# EAGLE design TowerLight (EAGLE 6.6.0)
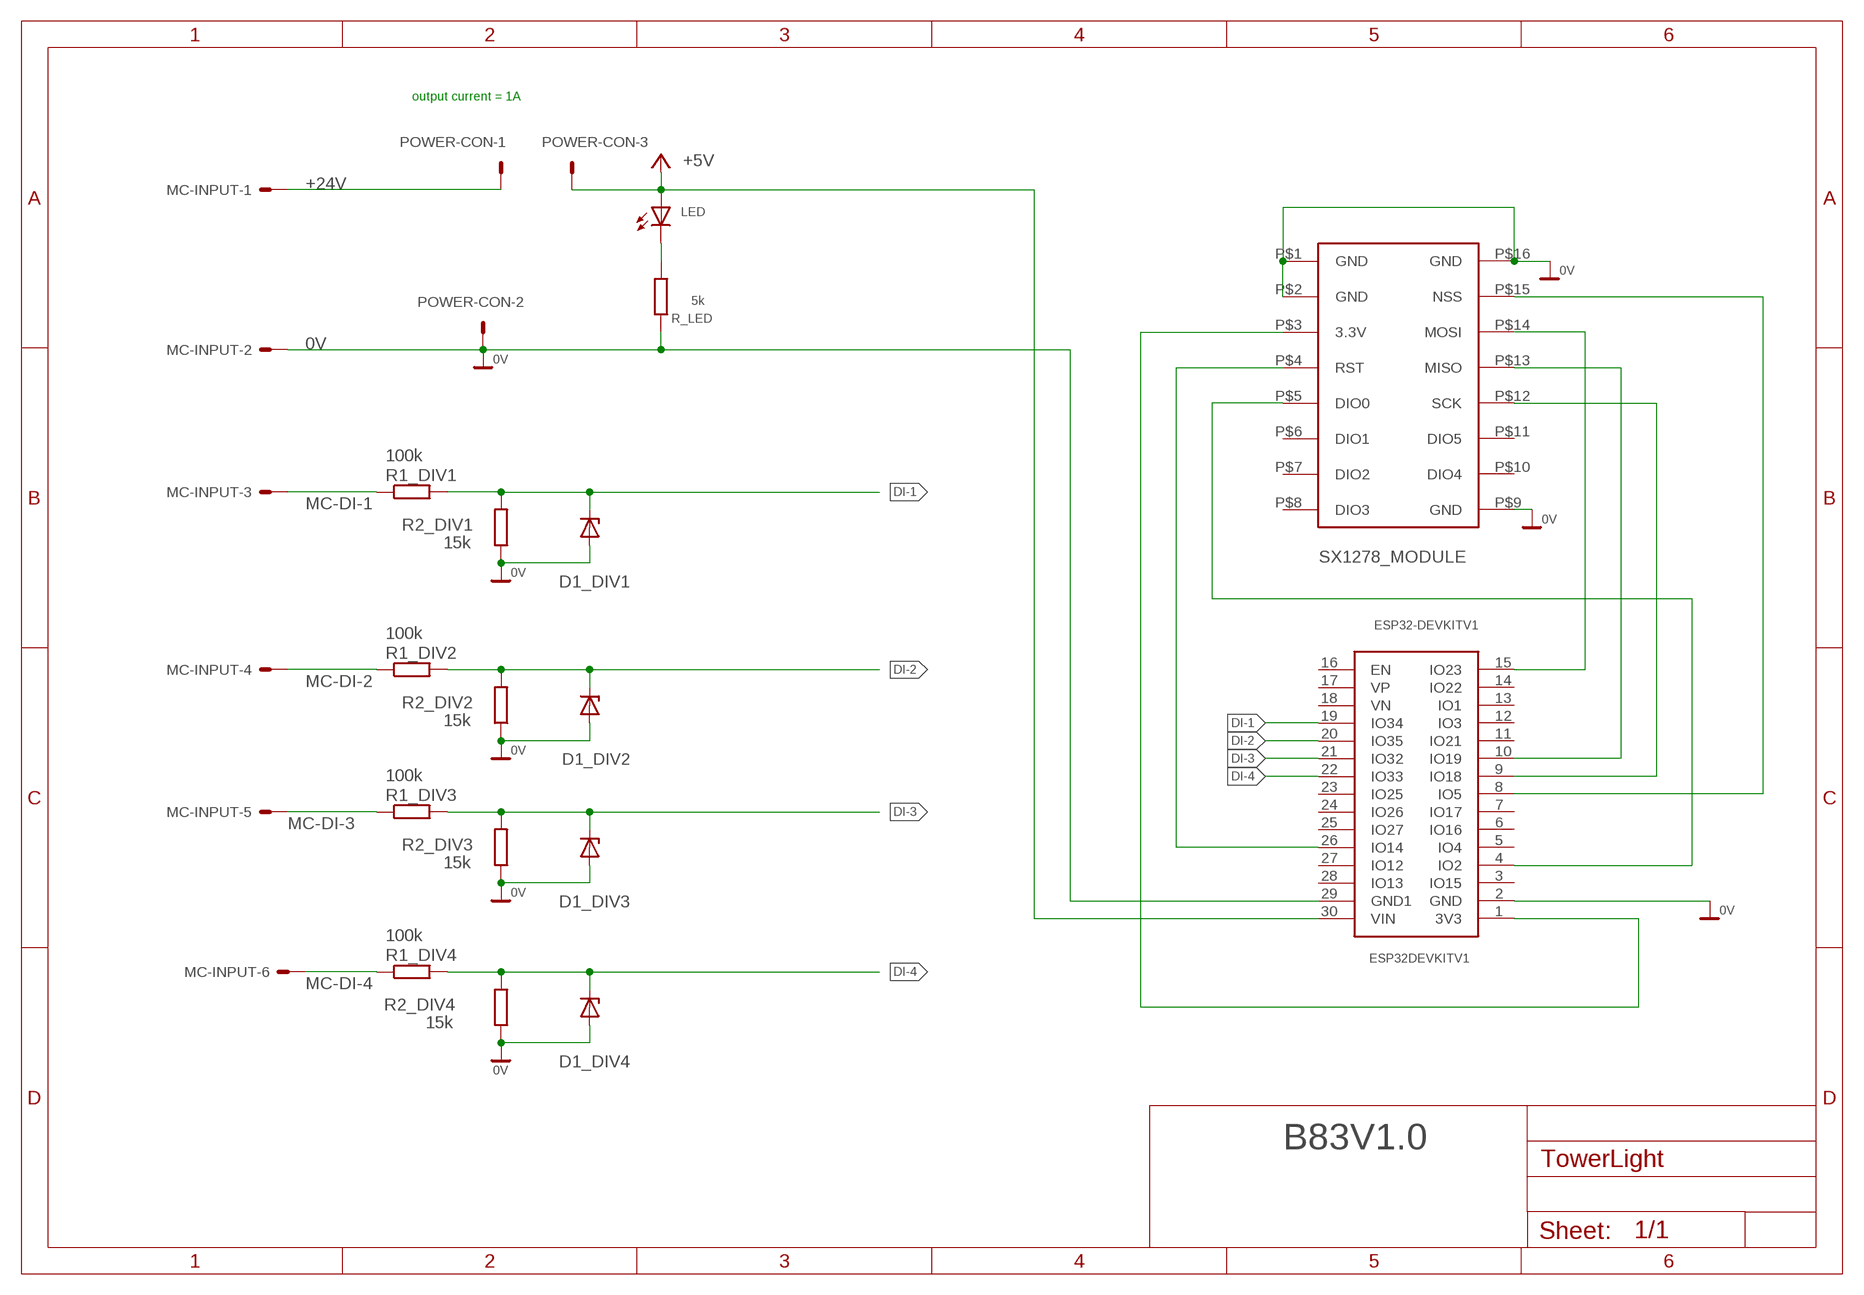
[diagram p0: schematic, sheet 1]

## Parts
D1_DIV1  ZENER-DIODEDO34-7  [DO34Z7]
D1_DIV2  ZENER-DIODEDO34-7  [DO34Z7]
D1_DIV3  ZENER-DIODEDO34-7  [DO34Z7]
D1_DIV4  ZENER-DIODEDO34-7  [DO34Z7]
ESP32DEVKITV1  ESP32DEVKITV1  [ESP32-DEVKITV1]
LED  LED_SUB  [LED_SUBMINI]
MC-INPUT  22-05-7068-06  [7395-06]
POWER-CON  22-05-7038-03  [7395-03]
R1_DIV1  100k  R-EU_R1206  [R1206]
R1_DIV2  100k  R-EU_R1206  [R1206]
R1_DIV3  100k  R-EU_R1206  [R1206]
R1_DIV4  100k  R-EU_R1206  [R1206]
R2_DIV1  15k  R-EU_R1206  [R1206]
R2_DIV2  15k  R-EU_R1206  [R1206]
R2_DIV3  15k  R-EU_R1206  [R1206]
R2_DIV4  15k  R-EU_R1206  [R1206]
R_LED  5k  R-EU_R1206  [R1206]
U$2  LORA-02_SX1278_MODULE  [LORA-02_SX1278_MODULE]

## Nets
0V: D1_DIV1.A D1_DIV2.A D1_DIV3.A D1_DIV4.A ESP32DEVKITV1.2(GND) ESP32DEVKITV1.29(GND1) MC-INPUT.2 POWER-CON.2 R2_DIV1.1 R2_DIV2.1 R2_DIV3.1 R2_DIV4.1 R_LED.2 U$2.P$1(GND) U$2.P$2(GND) U$2.P$9(GND) U$2.P$16(GND)
+3V3: ESP32DEVKITV1.30(VIN) LED.P$1(A) POWER-CON.3 ; supply symbol labelled +5V
+24V: MC-INPUT.1 POWER-CON.1
DI-1: D1_DIV1.C ESP32DEVKITV1.19(IO34) R1_DIV1.2 R2_DIV1.2
DI-2: D1_DIV2.C ESP32DEVKITV1.20(IO35) R1_DIV2.2 R2_DIV2.2
DI-3: D1_DIV3.C ESP32DEVKITV1.21(IO32) R1_DIV3.2 R2_DIV3.2
DI-4: D1_DIV4.C ESP32DEVKITV1.22(IO33) R1_DIV4.2 R2_DIV4.2
MC-DI-1: MC-INPUT.3 R1_DIV1.1
MC-DI-2: MC-INPUT.4 R1_DIV2.1
MC-DI-3: MC-INPUT.5 R1_DIV3.1
MC-DI-4: MC-INPUT.6 R1_DIV4.1
N$2: ESP32DEVKITV1.9(IO18) U$2.P$12(SCK)
N$3: LED.P$2(C) R_LED.1
N$4: ESP32DEVKITV1.10(IO19) U$2.P$13(MISO)
N$5: ESP32DEVKITV1.15(IO23) U$2.P$14(MOSI)
N$6: ESP32DEVKITV1.8(IO5) U$2.P$15(NSS)
N$7: ESP32DEVKITV1.4(IO2) U$2.P$5(DIO0)
N$8: ESP32DEVKITV1.1(3V3) U$2.P$3(3.3V)
N$9: ESP32DEVKITV1.26(IO14) U$2.P$4(RST)
Unconnected: ESP32DEVKITV1.3(IO15) ESP32DEVKITV1.5(IO4) ESP32DEVKITV1.6(IO16) ESP32DEVKITV1.7(IO17) ESP32DEVKITV1.11(IO21) ESP32DEVKITV1.12(IO3) ESP32DEVKITV1.13(IO1) ESP32DEVKITV1.14(IO22) ESP32DEVKITV1.16(EN) ESP32DEVKITV1.17(VP) ESP32DEVKITV1.18(VN) ESP32DEVKITV1.23(IO25) ESP32DEVKITV1.24(IO26) ESP32DEVKITV1.25(IO27) ESP32DEVKITV1.27(IO12) ESP32DEVKITV1.28(IO13) U$2.P$6(DIO1) U$2.P$7(DIO2) U$2.P$8(DIO3) U$2.P$10(DIO4) U$2.P$11(DIO5)

## Notes on the sheet
- output current = 1A
- B83V1.0

## Library data of the parts
D1_DIV1-D1_DIV4 = diode:ZENER-DIODE: Z-Diode
ESP32DEVKITV1 = ESP32-DEVKITV1:ESP32DEVKITV1
LED = ZH:LED_SUB
MC-INPUT = con-molex:22-?-06: CONNECTOR wire to board 2.54 mm (.1 inch) pitch header; OC_FARNELL: unknown; OC_NEWARK: unknown
POWER-CON = con-molex:22-?-03: CONNECTOR wire to board 2.54 mm (.1 inch) pitch header; OC_FARNELL: unknown; OC_NEWARK: unknown
R1_DIV1-R1_DIV4 R2_DIV1-R2_DIV4 R_LED = rcl:R-EU_: RESISTOR, European symbol
U$2 = simon:LORA-02_SX1278_MODULE: Created by Simon PS, Jun 2023

## Board
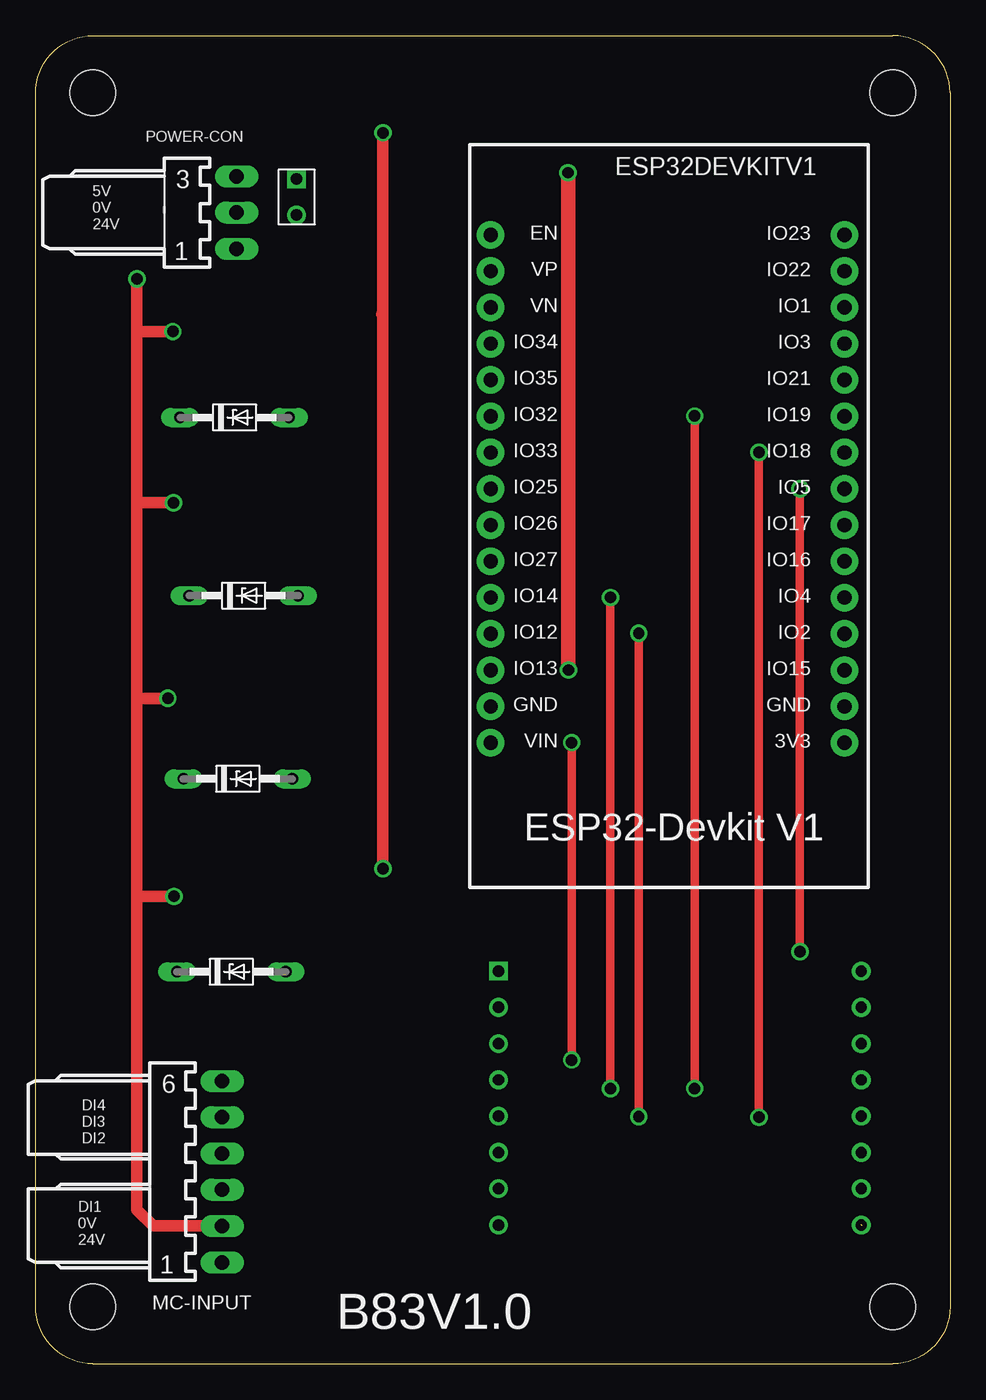
[diagram p1: board, top side]
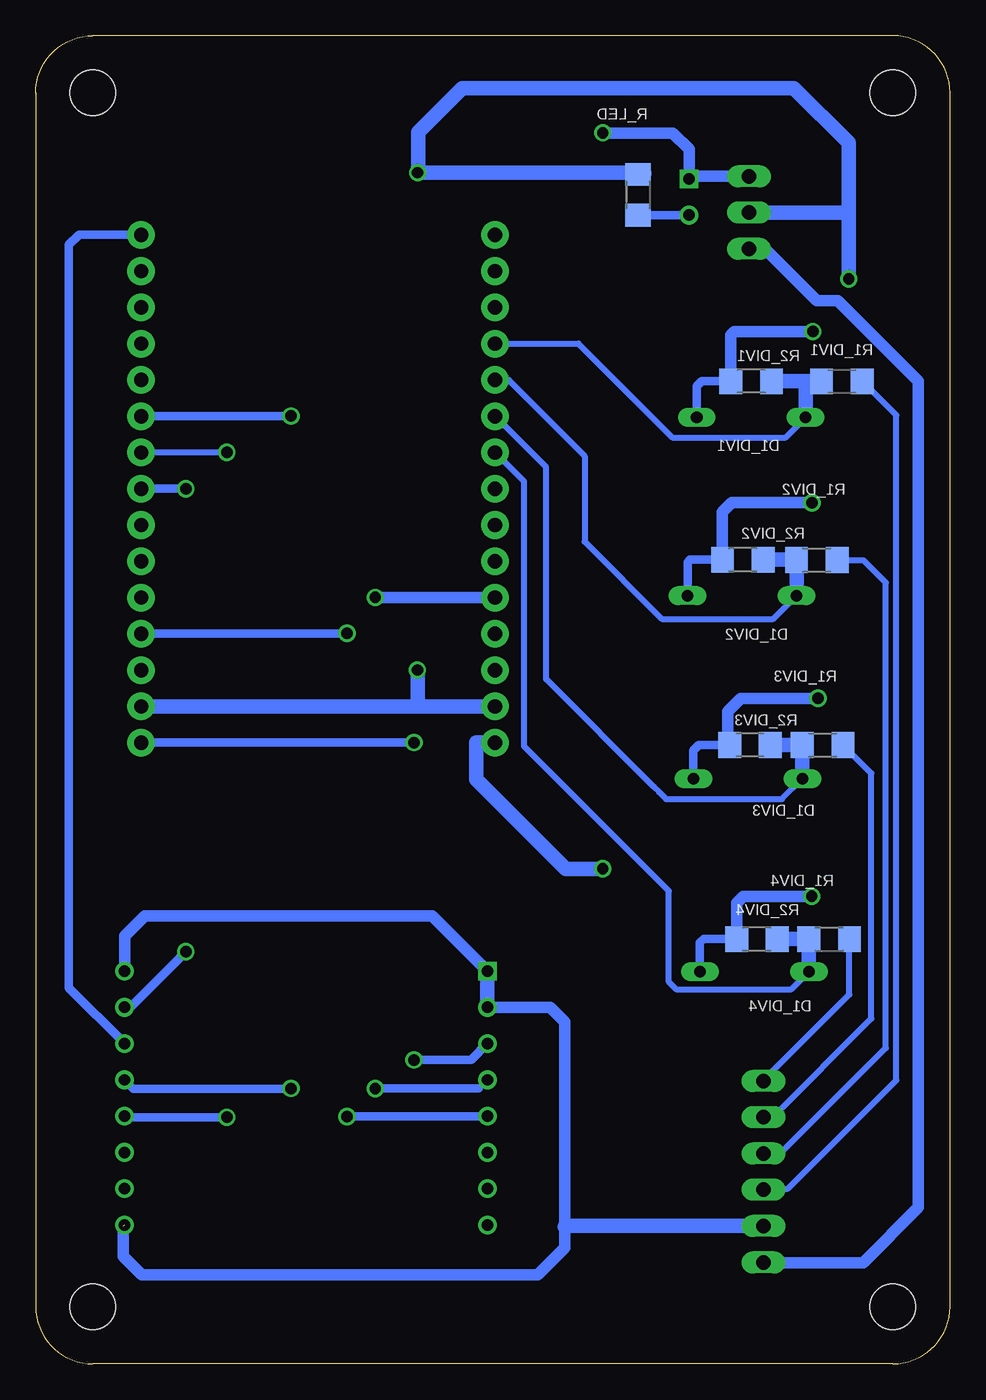
[diagram p2: board, bottom side, seen from below]

Size 64 x 93 mm. Coordinates in mm from the lower left corner, seen from the top.
Outline: 4,0 arc-90 0,4 0,89 arc-90 4,93 60,93 arc-90 64,89 64,4 arc-90 60,0 4,0
Copper layers (1*16): Top 0.035mm / dielectric 1.5mm / Bottom 0.035mm
Design rules "default *": minimum track width 10mil, minimum drill 24mil, track to track 8mil, track to pad 8mil, pad to pad 8mil, via to via 8mil, smd to smd 8mil, copper to edge 40mil, drill to drill 8mil, minimum pad ring 10mil, minimum via ring 8mil, stop-mask expansion 4mil, vias tented up to drill 0mil, thermal gap 10mil
Holes 3.2 mm at 4,4 60,4 4,89 60,89

### Footprints (pad centres in the part's own frame; a part is rotated, then mirrored left to right if it is on the bottom)
DO34Z7 = drill 0.813 long: A 3.81,0; C -3.81,0
ESP32-DEVKITV1 = drill 1 pad 1.93: 1 11,-13.98; 2 11,-11.44; 3 11,-8.9; 4 11,-6.36; 5 11,-3.82; 6 11,-1.28; 7 11,1.26; 8 11,3.8; 9 11,6.34; 10 11,8.88; 11 11,11.42; 12 11,13.96; 13 11,16.5; 14 11,19.04; 15 11,21.58; 16 -13.77,21.58; 17 -13.77,19.04; 18 -13.77,16.5; 19 -13.77,13.96; 20 -13.77,11.42; 21 -13.77,8.88; 22 -13.77,6.34; 23 -13.77,3.8; 24 -13.77,1.26; 25 -13.77,-1.28; 26 -13.77,-3.82; 27 -13.77,-6.36; 28 -13.77,-8.9; 29 -13.77,-11.44; 30 -13.77,-13.98
LED_SUBMINI = drill 0.8 square: P$1 0,2.54 | drill 0.8: P$2 0,0
7395-06 = drill 1.016 long: 1 6.35,0; 2 3.81,0; 3 1.27,0; 4 -1.27,0; 5 -3.81,0; 6 -6.35,0
7395-03 = drill 1.016 long: 1 2.54,0; 2 0,0; 3 -2.54,0
R1206 = smd 1.6 x 1.803: 1 -1.422,0; 2 1.422,0
LORA-02_SX1278_MODULE = drill 0.8 square: P$1 -12.7,10.16 | drill 0.8: P$2 -12.7,7.62; P$3 -12.7,5.08; P$4 -12.7,2.54; P$5 -12.7,0; P$6 -12.7,-2.54; P$7 -12.7,-5.08; P$8 -12.7,-7.62; P$9 12.7,-7.62; P$10 12.7,-5.08; P$11 12.7,-2.54; P$12 12.7,0; P$13 12.7,2.54; P$14 12.7,5.08; P$15 12.7,7.62; P$16 12.7,10.16

### Placement (x,y rotation side)
D1_DIV1  13.92,66.26 0 top
D1_DIV2  14.55,53.79 0 top
D1_DIV3  14.15,40.96 0 top
D1_DIV4  13.69,27.45 0 top
ESP32DEVKITV1  45.62,57.47 0 top
LED  18.26,80.44 0 top
MC-INPUT  13.06,13.46 270 top
POWER-CON  14.07,80.61 270 top
R1_DIV1  7.57,68.8 180 bottom
R1_DIV2  9.32,56.28 180 bottom
R1_DIV3  8.92,43.33 180 bottom
R1_DIV4  8.46,29.74 180 bottom
R2_DIV1  13.92,68.8 0 bottom
R2_DIV2  14.5,56.31 0 bottom
R2_DIV3  14,43.33 0 bottom
R2_DIV4  13.51,29.74 0 bottom
R_LED  21.84,81.86 90 bottom
U$2  45.09,17.34 0 top

### Tracks (layer width: path | path; a pad name or v marks a point on that pad's centre or on a via)
0V  (via drill 0.8)  (1 unrouted)
  Top 0.813: v7.09,75.97 7.09,72.31 | 7.09,72.31 7.09,60.24 | 7.09,60.24 7.09,46.65 | 7.09,46.65 7.09,32.63 | 7.09,32.63 7.09,10.79 8.23,9.65 MC-INPUT.2 | v9.6,72.28 7.11,72.28 7.09,72.31 | v9.65,60.29 7.14,60.29 7.09,60.24 | v9.25,46.6 7.14,46.6 7.09,46.65 | v9.68,32.73 7.19,32.73 7.09,32.63 | 37.29,83.38 v37.26,83.41
  Top 1.016: v37.29,48.59 37.29,83.38
  Bottom 0.406: POWER-CON.2 13.21,80.61 | 21.21,83.29 21.29,83.29 R_LED.2
  Bottom 0.61: D1_DIV1.A 17.73,68.45 17.38,68.8 R2_DIV1.1 | 15.54,43.2 R2_DIV3.1 | R2_DIV3.1 | R2_DIV4.1 | 14.99,29.69 R2_DIV4.1 | D1_DIV2.A 18.36,56.16 18.21,56.31 R2_DIV2.1 | D1_DIV3.A 17.96,42.95 17.58,43.33 R2_DIV3.1 | D1_DIV4.A 17.5,29.52 17.25,29.77 14.97,29.77 R2_DIV4.1
  Bottom 0.813: 7.09,79.06 7.09,78.82 | R2_DIV1.1 15.34,72.03 15.09,72.28 v9.6,72.28 | R2_DIV2.1 15.93,59.66 15.29,60.29 v9.65,60.29 | 15.54,43.2 15.54,45.67 14.63,46.58 9.27,46.58 v9.25,46.6 | R2_DIV4.1 14.94,32.28 14.48,32.73 v9.68,32.73 | 37.27,48.6 v37.29,48.59 | 21.41,83.41 21.29,83.29 | U$2.P$2 27.98,24.96 26.98,23.95 26.98,9.6 26.98,8.13 28.85,6.25 56.57,6.25 57.86,7.54 57.86,9.68 | U$2.P$16 57.78,29.95 56.36,31.37 36.25,31.37 U$2.P$1
  Bottom 1.016: v7.09,75.97 7.09,78.82 7.09,80.67 | 21.41,83.41 v37.26,83.41 37.24,83.43 37.24,86.23 34.14,89.33 10.92,89.33 7.09,85.5 7.09,80.67 | U$2.P$2 U$2.P$1 | ESP32DEVKITV1.2 37.24,46.03 | 37.24,46.03 ESP32DEVKITV1.29 | 37.27,48.6 37.27,46.07 37.24,46.03 | MC-INPUT.2 26.93,9.65 26.98,9.6 | POWER-CON.2 7.14,80.61 7.09,80.67
+3V3  (via drill 0.8)
  Top 0.813: v24.31,34.66 24.31,73.6 | 24.31,73.6 v24.31,86.2 | 24.21,73.5 24.31,73.6
  Bottom 0.813: 24.28,34.64 v24.31,34.66 | ESP32DEVKITV1.30 | v24.31,86.2 24.29,86.18 19.41,86.18 18.26,85.04 LED.P$1 18.09,83.15 POWER-CON.3
  Bottom 1.016: v24.31,34.66 26.9,34.66 33.15,40.91 33.15,43.49 ESP32DEVKITV1.30
+24V
  Bottom 0.813: MC-INPUT.1 13.03,7.08 6.07,7.08 2.21,10.94 2.21,68.8 7.85,74.44 9.32,74.44 12.95,78.07 POWER-CON.1
DI-1
  Bottom 0.406: ESP32DEVKITV1.19 31.84,71.44 26.01,71.44 19.43,64.87 11.51,64.87 D1_DIV1.C
  Bottom 1.016: R1_DIV1.2 10.16,68.8 | 10.16,68.8 R2_DIV1.2 | D1_DIV1.C 10.11,68.75 10.16,68.8
DI-2
  Bottom 0.406: ESP32DEVKITV1.20 31.84,68.89 30.89,68.89 25.57,63.57 25.57,57.57 20.17,52.17 12.37,52.17 D1_DIV2.C
  Bottom 1.016: D1_DIV2.C R1_DIV2.2 10.77,56.31 R2_DIV2.2
DI-3
  Bottom 0.406: ESP32DEVKITV1.21 28.27,62.78 28.27,47.95 20.73,40.41 20.36,40.04 19.86,39.54 11.76,39.54 D1_DIV3.C
  Bottom 1.016: R2_DIV3.2 R1_DIV3.2 D1_DIV3.C
DI-4
  Bottom 0.406: ESP32DEVKITV1.22 29.82,61.79 29.82,43.23 19.68,33.1 19.68,26.74 19.18,26.23 11.1,26.23 D1_DIV4.C
  Bottom 1.016: R2_DIV4.2 R1_DIV4.2 D1_DIV4.C
MC-DI-1
  Bottom 0.406: MC-INPUT.3 13.16,12.19 13.23,12.26 11.35,12.26 3.76,19.86 3.76,66.42 R1_DIV1.1
MC-DI-2
  Bottom 0.406: MC-INPUT.4 11.89,14.73 4.5,22.12 4.5,54.71 6.04,56.26 7.87,56.26 R1_DIV2.1
MC-DI-3
  Bottom 0.406: MC-INPUT.5 12.42,17.27 5.51,24.18 5.51,41.34 R1_DIV3.1
MC-DI-4
  Bottom 0.406: 13.06,19.83 7.04,25.85 R1_DIV4.1
  Bottom 0.813: MC-INPUT.6 13.06,19.83 | R1_DIV4.1
N$2  (via drill 0.8)
  Top 0.61: v50.62,17.27 v50.62,63.83
  Bottom 0.406: v50.62,17.27 | v50.62,63.83 56.61,63.83 ESP32DEVKITV1.9
  Bottom 0.61: v50.62,17.27 57.71,17.27 U$2.P$12
N$3
  Bottom 0.61: R_LED.1 LED.P$2
N$4  (via drill 0.8)
  Top 0.61: v46.13,19.28 v46.13,66.37
  Bottom 0.61: v46.13,19.28 46.14,19.27 57.17,19.27 U$2.P$13 | v46.13,66.37 56.6,66.37 ESP32DEVKITV1.10
N$5
  Bottom 0.61: ESP32DEVKITV1.15 56.64,79.08 60.95,79.08 61.67,78.35 61.67,26.31 U$2.P$14
N$6  (via drill 0.8)
  Top 0.61: v53.49,61.27 v53.49,28.85
  Bottom 0.61: ESP32DEVKITV1.8 53.5,61.27 v53.49,61.27 | 53.49,28.52 v53.49,28.85 57.38,24.96 U$2.P$15
N$7  (via drill 0.8)
  Top 0.61: v42.22,51.15 v42.22,17.32
  Bottom 0.406: 42.23,51.14 v42.22,51.15 | 32.41,17.32 U$2.P$5
  Bottom 0.61: 42.23,51.14 56.59,51.14 ESP32DEVKITV1.4 | v42.22,17.32 32.41,17.32
N$8  (via drill 0.8)
  Top 0.61: v37.52,43.51 v37.52,21.28
  Bottom 0.61: ESP32DEVKITV1.1 56.59,43.52 39.16,43.52 39.14,43.51 v37.52,43.51 | v37.52,21.28 33.53,21.28 U$2.P$3
N$9  (via drill 0.8)
  Top 0.61: v40.23,53.66 v40.23,19.27
  Bottom 0.406: 40.22,53.68 v40.23,53.66 | 32.99,19.27 U$2.P$4
  Bottom 0.61: v40.23,19.27 32.99,19.27
  Bottom 0.813: ESP32DEVKITV1.26 v40.22,53.66 v40.23,53.66

### Text on the board
tNames: 5V / 0V / 24V | DI4 / DI3 / DI2 | DI1 / 0V / 24V | B83V1.0